# Altium schematic sheet CHM_CPU_FPGA_Processor.SchDoc: CHOMIK CTRL Module
size A3; Author: Andrzej Cichocki; Organization: Space Research Centre; Address1: Bartycka 18a; Address2: 00-716 Warsaw; Address3: Poland; Revision: 1; ModuleName: FPGA IP-Core: Processor; SubOrganization1: FPGA Space Applications Lab.
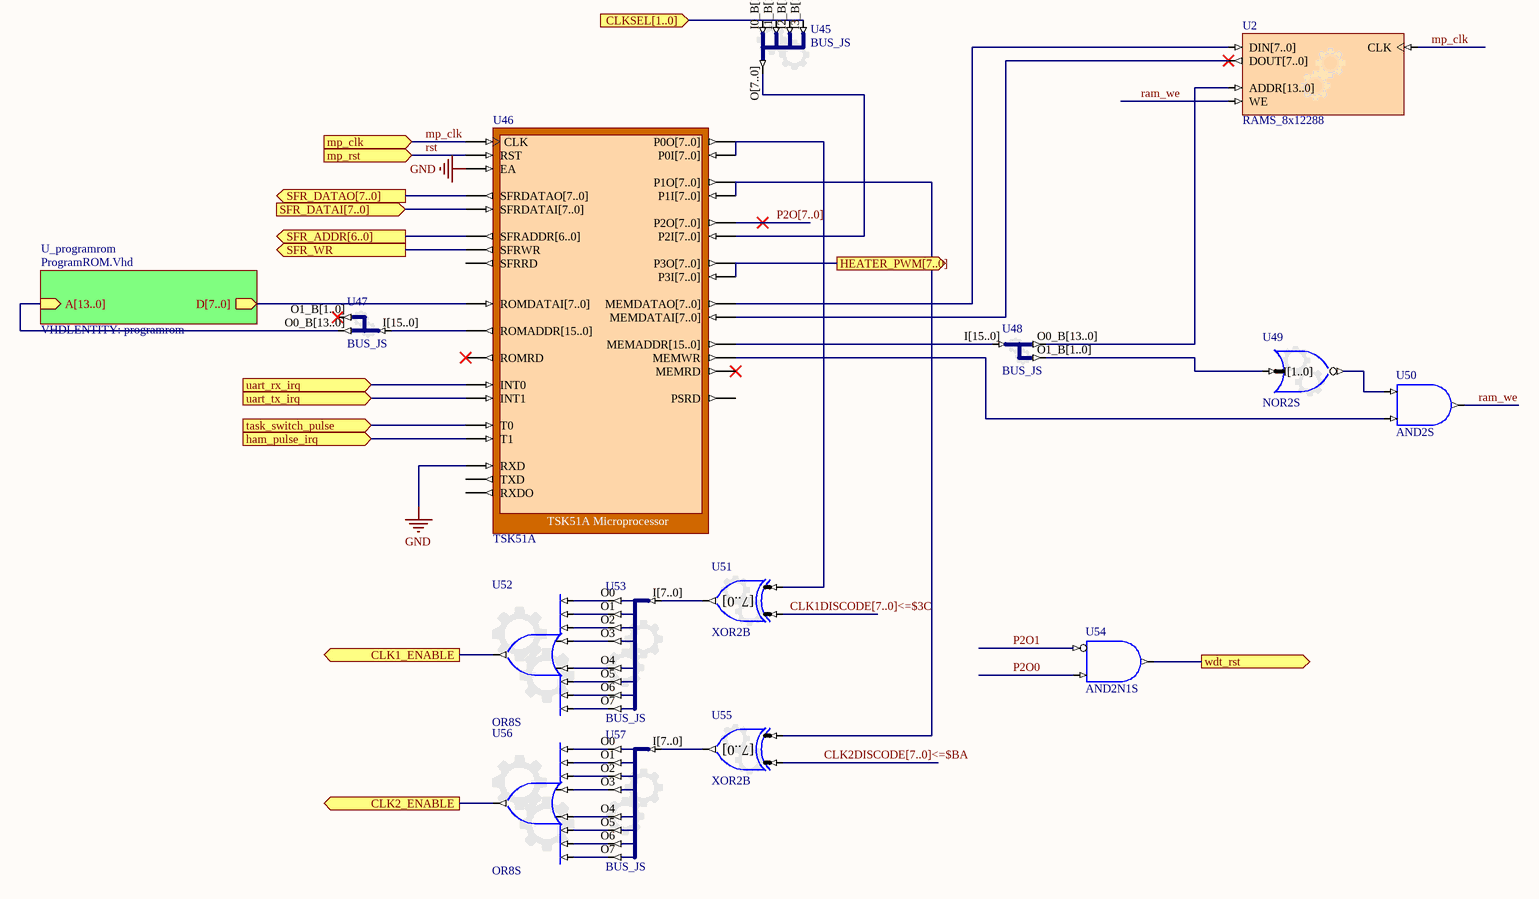
[diagram p0: CHM_CPU_FPGA_Processor.SchDoc]

## Parts
U2  RAMS_8x12288
U45  BUS_JS
U46  TSK51A
U47  BUS_JS
U48  BUS_JS
U49  NOR2S
U50  AND2S
U51  XOR2B
U52  OR8S
U53  BUS_JS
U54  AND2N1S
U55  XOR2B
U56  OR8S
U57  BUS_JS

## Sub-sheets
U_programrom = ProgramROM.Vhd: A[13..0] (in), D[7..0] (out)  | VHDLENTITY: programrom

## Ports
CLK1_ENABLE (out), CLK2_ENABLE (out), CLKSEL[1..0] (in), ham_pulse_irq (in), HEATER_PWM[7..0] (out), mp_clk (in), mp_rst (in), SFR_ADDR[6..0] (out), SFR_DATAI[7..0] (in), SFR_DATAO[7..0] (out), SFR_WR (out), task_switch_pulse (in), uart_rx_irq (in), uart_tx_irq (in), wdt_rst (out)

## Nets
GND: U46.EA U46.RXD
CLK1_ENABLE: U52.O ; port CLK1_ENABLE
CLK1DISCODE[7..0]<=$3C: U51.I0_B[7..0]
CLK2_ENABLE: U56.O ; port CLK2_ENABLE
CLK2DISCODE[7..0]<=$BA: U55.I0_B[7..0]
CLKSEL[1..0]: U45.I0_B[1..0] U45.I1_B[1..0] U45.I2_B[1..0] U45.I3_B[1..0] ; port CLKSEL[1..0]
ham_pulse_irq: U46.T1 ; port ham_pulse_irq
HEATER_PWM[7..0]: U46.P3I[7..0] U46.P3O[7..0] ; port HEATER_PWM[7..0]
mp_clk: U2.CLK U46.CLK ; port mp_clk
P2O0: U54.I1
P2O1: U54.I0
P2O[7..0]: U46.P2O[7..0]
ram_we: U2.WE U50.O
rst: U46.RST ; port mp_rst
SFR_ADDR[6..0]: U46.SFRADDR[6..0] ; port SFR_ADDR[6..0]
SFR_DATAI[7..0]: U46.SFRDATAI[7..0] ; port SFR_DATAI[7..0]
SFR_DATAO[7..0]: U46.SFRDATAO[7..0] ; port SFR_DATAO[7..0]
SFR_WR: U46.SFRWR ; port SFR_WR
task_switch_pulse: U46.T0 ; port task_switch_pulse
uart_rx_irq: U46.INT0 ; port uart_rx_irq
uart_tx_irq: U46.INT1 ; port uart_tx_irq
wdt_rst: U54.O ; port wdt_rst
NetU2_ADDR[13..0]: U2.ADDR[13..0] U48.O0_B[13..0]
NetU2_DIN[7..0]: U2.DIN[7..0] U46.MEMDATAO[7..0]
NetU2_DOUT[7..0]: U2.DOUT[7..0] U46.MEMDATAI[7..0]
NetU45_O[7..0]: U45.O[7..0] U46.P2I[7..0]
NetU46_MEMADDR[15..0]: U46.MEMADDR[15..0] U48.I[15..0]
NetU46_MEMWR: U46.MEMWR U50.I1
NetU46_P0I[7..0]: U46.P0I[7..0] U46.P0O[7..0] U51.I1_B[7..0]
NetU46_P1I[7..0]: U46.P1I[7..0] U46.P1O[7..0] U55.I1_B[7..0]
NetU46_ROMADDR[15..0]: U46.ROMADDR[15..0] U47.I[15..0]
NetU46_ROMDATAI[7..0]: U46.ROMDATAI[7..0] ; sheet U_programrom/D[7..0]
NetU47_O0_B[13..0]: U47.O0_B[13..0] ; sheet U_programrom/A[13..0]
NetU48_O1_B[1..0]: U48.O1_B[1..0] U49.I[1..0]
NetU49_O: U49.O U50.I0
NetU51_O[7..0]: U51.O[7..0] U53.I[7..0]
NetU52_I0: U52.I0 U53.O7
NetU52_I1: U52.I1 U53.O6
NetU52_I2: U52.I2 U53.O5
NetU52_I3: U52.I3 U53.O4
NetU52_I4: U52.I4 U53.O3
NetU52_I5: U52.I5 U53.O2
NetU52_I6: U52.I6 U53.O1
NetU52_I7: U52.I7 U53.O0
NetU55_O[7..0]: U55.O[7..0] U57.I[7..0]
NetU56_I0: U56.I0 U57.O7
NetU56_I1: U56.I1 U57.O6
NetU56_I2: U56.I2 U57.O5
NetU56_I3: U56.I3 U57.O4
NetU56_I4: U56.I4 U57.O3
NetU56_I5: U56.I5 U57.O2
NetU56_I6: U56.I6 U57.O1
NetU56_I7: U56.I7 U57.O0

Not connected (* = marked no-connect by the designer): U46 MEMRD* PSRD ROMRD* RXDO SFRRD TXD; U47 O1_B[1..0]*

## Buses and harness runs
bus CLK1DISCODE[7..0]<=$3C
bus CLK2DISCODE[7..0]<=$BA
bus P2O[7..0]

## Notes on the sheet
- Module:
- Project:
- Modified:
- Rev.:
- Author:
- (in symbol GATE) [7..0]

## Library data of the parts
U2 = MEMORY: Configurable Memory; ConfiguratorName: GENERIC_MEMORY; ConfigurationParameters: {}Version[1.0]{}Option_MemoryDepthText[12288]{}Option_MemoryWidth[8]{}Option_PortCount[0]{}Option_MemoryType[0]{}Option_ByteWrites[False]{}Option_RisingEdgeClock[True]{}Option_EnablePin[False]{}Option_ResetPin[False]{}Option_UseDistributed[False]{}Option_InitMemoryFlag[False]{}Option_MemoryFileName[ ]{}Option_MemoryFileEndiannessBig[True]{}Option_MemoryFileEndiannessLittle[False]{}; LastRevisionNo: 1.00.00; Published: 28-Oct-2008; Publisher: Altium Limited; HelpURL: https://wiki.altium.com/display/ADOH/Configurable+Generic+Library
U45 = BUS_JS: Configurable Bus Joiner/Splitter; ConfiguratorName: GENERIC_BUS_JS; ConfigurationParameters: {}Version[1.1]{}SplitterJoinerType[Joiner]{}SignalCount[4]{}SignalWidth0[2]{}GapBelow0[1000000]{}ConnectionType0[Pin]{}SignalWidth1[2]{}GapBelow1[1000000]{}ConnectionType1[Pin]{}SignalWidth2[2]{}GapBelow2[1000000]{}ConnectionType2[Pin]{}SignalWidth3[2]{}GapBelow3[1000000]{}ConnectionType3[Pin]{}ShowPinNames[True]{}; LastRevisionNo: 1.00.00; Published: 17-Sep-2008; Publisher: Altium Limited; HelpURL: https://wiki.altium.com/display/ADOH/Configurable+Generic+Library
U46 = TSK51A: TSK51A Microprocessor; ChildModel1: RAM256x8_TSK51; ChildModel2: RAM256x8_TSK51_prim0; NEXUS_CORE: Processor_Normal; Published: 17-Nov-2004; Publisher: Altium Limited; ComponentLink1Description: Core &Resource Usage; ComponentLink1URL: CR0140 FPGA Processor Resource Usage.pdf#page=8; HelpURL: https://wiki.altium.com/display/ADOH/TSK51x+MCU; LastRevisionNo: 1.00.00; ComponentLink2Description: Embedded &Tools Guide; ComponentLink2URL: https://wiki.altium.com/download/attachments/3080695/GU0107+Using+the+TSK51x+TSK52x+Embedded+Tools.pdf?version=1; ComponentLink3Description: Embedded T&echnical References; ComponentLink3URL: https://wiki.altium.com/download/attachments/3080695/TR0105+TSK51x+TSK52x+Embedded+Tools+Reference.pdf?version=1
U47 U48 = BUS_JS: Configurable Bus Joiner/Splitter; ConfiguratorName: GENERIC_BUS_JS; ConfigurationParameters: {}Version[1.1]{}SplitterJoinerType[Splitter]{}SignalCount[2]{}SignalWidth0[14]{}GapBelow0[1000000]{}ConnectionType0[Pin]{}SignalWidth1[2]{}GapBelow1[1000000]{}ConnectionType1[Pin]{}ShowPinNames[True]{}; LastRevisionNo: 1.00.00; Published: 17-Sep-2008; Publisher: Altium Limited; HelpURL: https://wiki.altium.com/display/ADOH/Configurable+Generic+Library
U49 = GATE: Configurable Generic Gate; ConfiguratorName: GENERIC_GATE; ConfigurationParameters: {}Version[1.1]{}GateKind[NOR]{}BusInput[True]{}GateInputType[Bit]{}GateOutputOption[Normal]{}BusWidth[8]{}RegisterOutputs[False]{}NegativeClockEdge[False]{}InputCount[2]{}InputInvert0[False]{}InputInvert1[False]{}; LastRevisionNo: 1.00.00; Published: 3-Sep-2008; Publisher: Altium Limited; HelpURL: https://wiki.altium.com/display/ADOH/Configurable+Generic+Library
U50 = AND2S: 2-Input AND Gate, Single Pin Version; Xilinx Equivalent: AND2; ArchiveName: GENERIC; VHDLIB_SIM: GENERIC_LIB; Published: 29-Jan-2004; Publisher: Altium Limited; Core Revision: 1.00.00
U51 U55 = GATE: Configurable Generic Gate; ConfiguratorName: GENERIC_GATE; ConfigurationParameters: {}Version[1.1]{}GateKind[XOR]{}BusInput[False]{}GateInputType[Bus]{}GateOutputOption[Normal]{}BusWidth[8]{}RegisterOutputs[False]{}NegativeClockEdge[False]{}InputCount[2]{}InputInvert0[False]{}InputInvert1[False]{}; LastRevisionNo: 1.00.00; Published: 3-Sep-2008; Publisher: Altium Limited; HelpURL: https://wiki.altium.com/display/ADOH/Configurable+Generic+Library
U52 U56 = GATE: Configurable Generic Gate; ConfiguratorName: GENERIC_GATE; ConfigurationParameters: {}Version[1.1]{}GateKind[OR]{}BusInput[False]{}GateInputType[Bit]{}GateOutputOption[Normal]{}BusWidth[8]{}RegisterOutputs[False]{}NegativeClockEdge[False]{}InputCount[8]{}InputInvert0[False]{}InputInvert1[False]{}InputInvert2[False]{}InputInvert3[False]{}InputInvert4[False]{}InputInvert5[False]{}InputInvert6[False]{}InputInvert7[False]{}; LastRevisionNo: 1.00.00; Published: 3-Sep-2008; Publisher: Altium Limited; HelpURL: https://wiki.altium.com/display/ADOH/Configurable+Generic+Library
U53 U57 = BUS_JS: Configurable Bus Joiner/Splitter; ConfiguratorName: GENERIC_BUS_JS; ConfigurationParameters: {}Version[1.1]{}SplitterJoinerType[Splitter]{}SignalCount[8]{}SignalWidth0[1]{}GapBelow0[1000000]{}ConnectionType0[Pin]{}SignalWidth1[1]{}GapBelow1[1000000]{}ConnectionType1[Pin]{}SignalWidth2[1]{}GapBelow2[1000000]{}ConnectionType2[Pin]{}SignalWidth3[1]{}GapBelow3[2000000]{}ConnectionType3[Pin]{}SignalWidth4[1]{}GapBelow4[1000000]{}ConnectionType4[Pin]{}SignalWidth5[1]{}GapBelow5[1000000]{}ConnectionType5[Pin]{}SignalWidth6[1]{}GapBelow6[1000000]{}ConnectionType6[Pin]{}SignalWidth7[1]{}GapBelow7[1000000]{}ConnectionType7[Pin]{}ShowPinNames[True]{}; LastRevisionNo: 1.00.00; Published: 17-Sep-2008; Publisher: Altium Limited; HelpURL: https://wiki.altium.com/display/ADOH/Configurable+Generic+Library
U54 = AND2N1S: 2-Input AND Gate with Active Low A Input, Single Pin Version; XilinxEquivalent: AND2B1; FunctionalClass: Logic Primitive; PortSize: 2; ArchiveName: GENERIC; VHDLIB_SIM: GENERIC_LIB; Published: 29-Jan-2004; Publisher: Altium Limited; LastRevisionNo: 1.00.00; HelpURL: CR0118 FPGA Generic Library Guide.pdf#page=114; ComponentLink1URL: CR0136 FPGA Logic Primitive Resource Usage.pdf#page=10; ComponentLink1Description: Core &Resource Usage; SubClass: AND; PortStyle: Single Pin Version